# Altium schematic sheet PowerPath.SchDoc: Power Path
size A4; DrawnBy: A. Küllenberg; Revision: A; SheetNumber: 4; SheetTotal: 10
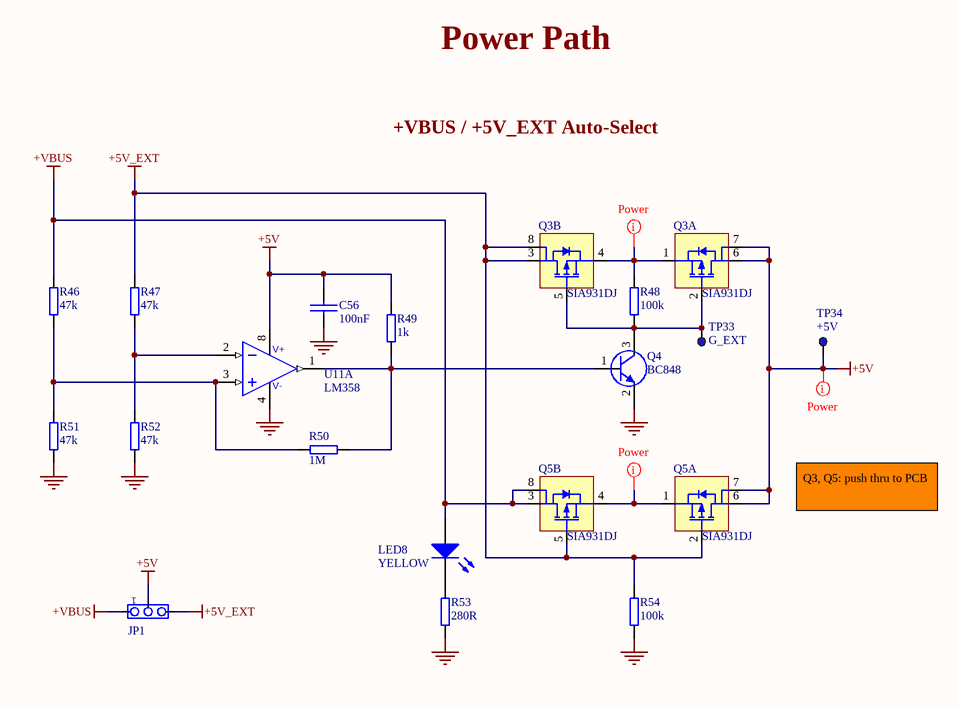
[diagram p0: PowerPath.SchDoc]

## Parts
C56  100nF  [C0603]
JP1  JP  [HDR1x3]  (value not drawn)
LED8  YELLOW  [LED_0603_YELLOW]
Q3  SIA931DJ  [PowerPAK SC-70-6L Dual]  (parts A,B of 2)
Q4  BC848  [SC-70]
Q5  SIA931DJ  [PowerPAK SC-70-6L Dual]  (parts A,B of 2)
R46  47k  [R0603]
R47  47k  [R0603]
R48  100k  [R0603]
R49  1k  [R0603]
R50  1M  [R0603]
R51  47k  [R0603]
R52  47k  [R0603]
R53  280R  [R0603]
R54  100k  [R0603]
TP33  G_EXT  [TP_1mm]  (no BOM)
TP34  +5V  [TP_1mm]  (no BOM)
U11  LM358  [DFN 2x2_LM358]  (part A of 2)

## Nets
+5V: C56.2 JP1.2 Q3.6(D1) Q3.7(D1) Q5.6(D1) Q5.7(D1) R49.2 TP34.1 U11.8(V+)
+5V_EXT: JP1.3 Q3.3(D2) Q3.8(D2) Q5.2(G1) Q5.5(G2) R47.2 R54.2
+VBUS: JP1.1 LED8.1(A) Q5.3(D2) Q5.8(D2) R46.2
GND: C56.1 Q4.2 R51.1 R52.1 R53.1 R54.1 U11.4(V-)
NetLED8_2: LED8.2(K) R53.2
NetQ3_1: Q3.1(S1) Q3.4(S2) R48.2
NetQ3_2: Q3.2(G1) Q3.5(G2) Q4.3 R48.1 TP33.1
NetQ4_1: Q4.1 R49.1 R50.1 U11.1(OUT)
NetQ5_1: Q5.1(S1) Q5.4(S2)
NetR46_1: R46.1 R50.2 R51.2 U11.3(IN+)
NetR47_1: R47.1 R52.2 U11.2(IN-)

## Layout directives
net class Power: +5V, NetQ3_1, NetQ5_1

## Notes on the sheet
- Power Path
- +VBUS / +5V_EXT Auto-Select
- Q3, Q5: push thru to PCB

## Library data of the parts
C56 = C0603C104K5RACTU: CAP CER 0.1UF 50V X7R 0603; Manufacturer: Kemet; Capacitance: 0.10µF; Tolerance: ±10%; Part Number: C0603C104K5RACTU; Value: 100nF; Supplier 1: Digi-Key; Supplier Part Number 1: 399-5089-1-ND; Manufacturer Part Number: C0603C104K5RACTU; RoHS: RoHS Compliant; Category: Capacitors; Stock 1: 1628757; Pricing 1: 1=0.09, 10=0.037, 50=0.0198, 100=0.0167, 250=0.01372, 500=0.01174, 1000=0.00914 (EUR); Packaging: Cut Tape (CT); Voltage - Rated: 50V; Temperature Coefficient: X7R; Mounting Type: Surface Mount, MLCC; Operating Temperature: -55°C ~ 125°C; Applications: General Purpose; Ratings: -; Package / Case: 0603 (1608 Metric); Size / Dimension: 0.063" L x 0.031" W (1.60mm x 0.80mm); Height - Seated (Max): -; Thickness (Max): 0.034" (0.87mm); Lead Spacing: -; Features: -; Lead Style: -; ComponentLink1URL: http://www.kemet.com/docfinder?Partnumber=C0603C104K5RACTU; ComponentLink1Description: http://www.kemet.com/docfinder?Partnumber=C0603C104K5RACTU
JP1 = 61300311121: CONN HEADER 3 POS 2.54; Manufacturer: Wurth Electronics Inc.; Pitch - Mating: 0.100" (2.54mm); Style: Board to Board or Cable; Shrouding: Unshrouded; Number of Positions: 3; Number of Positions Loaded: All; Contact Length - Mating: 0.236" (6.00mm); Contact Length - Post: 0.118" (3.00mm); Overall Contact Length: 0.454" (11.54mm); Material Flammability Rating: UL94 V-0; Current Rating: 3A; Voltage Rating: 250V; Part Number: 61300311121; Value: JP; Supplier 1: Digi-Key; Supplier Part Number 1: 732-5316-ND; Manufacturer Part Number: 61300311121; RoHS: RoHS Compliant; Category: Connectors, Interconnects; Stock 1: 31558; Pricing 1: 1=0.21, 10=0.191, 25=0.1628, 50=0.1424, 100=0.1323, 1000=0.09157 (EUR); Packaging: Bulk; Part Status: Active; Connector Type: Header; Contact Type: Male Pin; Number of Rows: 1; Row Spacing - Mating: -; Mounting Type: Through Hole; Termination: Solder; Fastening Type: -; Insulation Height: 0.100" (2.54mm); Contact Shape: Square; Contact Finish - Mating: Gold; Contact Finish Thickness - Mating: -; Contact Finish - Post: -; Contact Material: Copper Alloy; Insulation Material: Polybutylene Terephthalate (PBT); Features: -; Operating Temperature: -40°C ~ 125°C; Ingress Protection: -; Insulation Color: Black; Mated Stacking Heights: -; Contact Finish Thickness - Post: -; Applications: -; ComponentLink1URL: http://katalog.we-online.de/em/datasheet/6130xx11121.pdf; ComponentLink1Description: http://katalog.we-online.de/em/datasheet/6130xx11121.pdf
LED8 = LTST-C190KSKT: LED YELLOW CLEAR 0603 SMD; Manufacturer: Lite-On Inc.; Voltage - Forward (Vf) (Typ): 2.1V; Viewing Angle: 130°; Wavelength - Dominant: 591nm; Wavelength - Peak: 588nm; Millicandela Rating: 104mcd; Current - Test: 20mA; Lens Color: Colorless; Lens Style/Size: Rectangle with Flat Top, 1.10mm x 0.80mm; Part Number: LTST-C190KSKT; Value: YELLOW; Supplier 1: Digi-Key; Supplier Part Number 1: 160-1437-1-ND; Manufacturer Part Number: LTST-C190KSKT; RoHS: RoHS Compliant; Category: Optoelectronics; Stock 1: 229638; Pricing 1: 1=0.27, 10=0.199, 25=0.1468, 100=0.1049, 250=0.07132, 500=0.06292, 1000=0.0493 (EUR); Packaging: Cut Tape (CT); Mounting Type: Surface Mount; Package / Case: 0603 (1608 Metric); ComponentLink1URL: http://optoelectronics.liteon.com/upload/download/DS-22-99-0189/S_110_LTST-C190KSKT.pdf; ComponentLink1Description: http://optoelectronics.liteon.com/upload/download/DS-22-99-0189/S_110_LTST-C190KSKT.pdf; Color: Yellow; Lens Transparency: Clear; Size / Dimension: 1.60mm L x 0.80mm W; Height (Max): 0.80mm; Features: -; Part Status: Active
Q3 Q5 = SIA931DJ-T1-GE3: MOSFET 2P-CH 30V 4.5A SC70-6L; Manufacturer: Vishay Siliconix; FET Type: 2 P-Channel (Dual); FET Feature: Logic Level Gate; Rds On (Max) @ Id, Vgs: 65 mOhm @ 3A, 10V; Vgs(th) (Max) @ Id: 2.2V @ 250µA; Power - Max: 7.8W; Gate Charge (Qg) (Max) @ Vgs: 13nC @ 10V; Input Capacitance (Ciss) (Max) @ Vds: 445pF @ 15V; Part Number: SIA931DJ-T1-GE3; Value: SIA931DJ; Supplier 1: Digi-Key; Supplier Part Number 1: SIA931DJ-T1-GE3CT-ND; Manufacturer Part Number: SIA931DJ-T1-GE3; RoHS: RoHS Compliant; Category: Discrete Semiconductor Products; Stock 1: 5457; Pricing 1: 1=0.51, 10=0.44, 25=0.4108, 100=0.3287, 250=0.30524, 500=0.2583, 1000=0.19959 (EUR); Packaging: Cut Tape (CT); Drain to Source Voltage (Vdss): 30V; Current - Continuous Drain (Id) @ 25°C: 4.5A; Mounting Type: Surface Mount; Package / Case: PowerPAK® SC-70-6 Dual; Supplier Device Package: PowerPAK® SC-70-6 Dual; ComponentLink1URL: http://www.vishay.com/docs/62859/sia931dj.pdf; ComponentLink1Description: http://www.vishay.com/docs/62859/sia931dj.pdf; Operating Temperature: -55°C ~ 150°C (TJ); Part Status: Active
Q4 = BC848W,115: TRANS NPN 30V 0.1A SOT323; Manufacturer: Nexperia USA Inc.; Current - Collector (Ic) (Max): 100mA; Vce Saturation (Max) @ Ib, Ic: 600mV @ 5mA, 100mA; Current - Collector Cutoff (Max): 15nA (ICBO); DC Current Gain (hFE) (Min) @ Ic, Vce: 110 @ 2mA, 5V; Power - Max: 200mW; Frequency - Transition: 100MHz; Part Number: BC848W,115; Value: BC848; Supplier 1: Digi-Key; Supplier Part Number 1: 1727-6193-1-ND; Manufacturer Part Number: BC848W,115; RoHS: RoHS Compliant; Category: Discrete Semiconductor Products; Stock 1: 2939; Pricing 1: 1=0.13, 10=0.12, 100=0.0651, 500=0.04004, 1000=0.02731 (EUR); Packaging: Cut Tape (CT); Part Status: Active; Transistor Type: NPN; Voltage - Collector Emitter Breakdown (Max): 30V; Operating Temperature: 150°C (TJ); Mounting Type: Surface Mount; Package / Case: SC-70, SOT-323; Supplier Device Package: SOT-323-3; ComponentLink1URL: http://assets.nexperia.com/documents/data-sheet/BC848_SER.pdf; ComponentLink1Description: http://assets.nexperia.com/documents/data-sheet/BC848_SER.pdf
R46 R47 R51 R52 = RC0603FR-0747KL: RES SMD 47K OHM 1% 1/10W 0603; Manufacturer: Yageo; Power (Watts): 0.1W, 1/10W; Temperature Coefficient: ±100ppm/°C; Part Number: RC0603FR-0747KL; Value: 47k; Manufacturer Part Number: RC0603FR-0747KL; RoHS: RoHS Compliant; Category: Resistors; Stock 1: 2291730; Pricing 1: 1=0.09, 10=0.012, 25=0.0088, 50=0.007, 100=0.0051, 250=0.00388, 500=0.0031, 1000=0.00229 (EUR); Packaging: Cut Tape (CT); Resistance (Ohms): 47k; Tolerance: ±1%; Composition: Thick Film; Features: Moisture Resistant; Operating Temperature: -55°C ~ 155°C; Package / Case: 0603 (1608 Metric); Supplier Device Package: 0603; Size / Dimension: 0.063" L x 0.031" W (1.60mm x 0.80mm); ComponentLink1URL: http://www.yageo.com/documents/recent/PYu-RC_Group_51_RoHS_L_7.pdf; ComponentLink1Description: http://www.yageo.com/documents/recent/PYu-RC_Group_51_RoHS_L_7.pdf; Supplier 1: Digi-Key; Supplier Part Number 1: 311-47.0KHRCT-ND; Height - Seated (Max): 0.022" (0.55mm); Part Status: Active; Failure Rate: -
R48 R54 = RC0603FR-07100KL: RES SMD 100K OHM 1% 1/10W 0603; Manufacturer: Yageo; Power (Watts): 0.1W, 1/10W; Temperature Coefficient: ±100ppm/°C; Part Number: RC0603FR-07100KL; Value: 100k; Manufacturer Part Number: RC0603FR-07100KL; RoHS: RoHS Compliant; Category: Resistors; Stock 1: 6595647; Pricing 1: 1=0.09, 10=0.012, 25=0.0088, 50=0.007, 100=0.0051, 250=0.00388, 500=0.0031, 1000=0.00229 (EUR); Packaging: Cut Tape (CT); Resistance (Ohms): 100k; Tolerance: ±1%; Composition: Thick Film; Features: Moisture Resistant; Operating Temperature: -55°C ~ 155°C; Package / Case: 0603 (1608 Metric); Supplier Device Package: 0603; Size / Dimension: 0.063" L x 0.031" W (1.60mm x 0.80mm); ComponentLink1URL: http://www.yageo.com/documents/recent/PYu-RC_Group_51_RoHS_L_7.pdf; ComponentLink1Description: http://www.yageo.com/documents/recent/PYu-RC_Group_51_RoHS_L_7.pdf; Supplier 1: Digi-Key; Supplier Part Number 1: 311-100KHRCT-ND; Height - Seated (Max): 0.022" (0.55mm); Part Status: Active; Failure Rate: -
R49 = CRCW06031K00FKEA: RES SMD 1K OHM 1% 1/10W 0603; Manufacturer: Vishay Dale; Power (Watts): 0.1W, 1/10W; Temperature Coefficient: ±100ppm/°C; Part Number: CRCW06031K00FKEA; Value: 1k; Manufacturer Part Number: CRCW06031K00FKEA; RoHS: RoHS Compliant; Category: Resistors; Stock 1: 862886; Pricing 1: 1=0.09, 10=0.027, 25=0.0196, 50=0.015, 100=0.011, 250=0.0084, 500=0.00674, 1000=0.00496, 2500=0.00431 (EUR); Packaging: Cut Tape (CT); Resistance (Ohms): 1k; Tolerance: ±1%; Composition: Thick Film; Features: Automotive AEC-Q200; Operating Temperature: -55°C ~ 155°C; Package / Case: 0603 (1608 Metric); Supplier Device Package: 0603; Size / Dimension: 0.061" L x 0.033" W (1.55mm x 0.85mm); Height: 0.020" (0.50mm); Number of Terminations: 2; ComponentLink1URL: http://www.vishay.com/docs/20035/dcrcwe3.pdf; ComponentLink1Description: http://www.vishay.com/docs/20035/dcrcwe3.pdf; Supplier 1: Digi-Key; Supplier Part Number 1: 541-1.00KHCT-ND
R50 = RC0603FR-071ML: RES SMD 1M OHM 1% 1/10W 0603; Manufacturer: Yageo; Power (Watts): 0.1W, 1/10W; Temperature Coefficient: ±100ppm/°C; Part Number: RC0603FR-071ML; Value: 1M; Manufacturer Part Number: RC0603FR-071ML; RoHS: RoHS Compliant; Category: Resistors; Stock 1: 3055845; Pricing 1: 1=0.09, 10=0.012, 25=0.0088, 50=0.0066, 100=0.0049, 250=0.00372, 500=0.00298, 1000=0.0022 (EUR); Packaging: Cut Tape (CT); Resistance (Ohms): 1M; Tolerance: ±1%; Composition: Thick Film; Features: Moisture Resistant; Operating Temperature: -55°C ~ 155°C; Package / Case: 0603 (1608 Metric); Supplier Device Package: 0603; Size / Dimension: 0.063" L x 0.031" W (1.60mm x 0.80mm); ComponentLink1URL: http://www.yageo.com/documents/recent/PYu-RC_Group_51_RoHS_L_7.pdf; ComponentLink1Description: http://www.yageo.com/documents/recent/PYu-RC_Group_51_RoHS_L_7.pdf; Supplier 1: Digi-Key; Supplier Part Number 1: 311-1.00MHRCT-ND; Height - Seated (Max): 0.022" (0.55mm); Part Status: Active; Failure Rate: -
R53 = RC0603FR-07280RL: RES SMD 280 OHM 1% 1/10W 0603; Manufacturer: Yageo; Resistance (Ohms): 280; Power (Watts): 0.1W, 1/10W; Temperature Coefficient: ±100ppm/°C; Part Number: RC0603FR-07280RL; Value: 280R; Manufacturer Part Number: RC0603FR-07280RL; RoHS: RoHS Compliant; Category: Resistors; Stock 1: 47; Pricing 1: 1=0.09, 10=0.012, 25=0.0088, 50=0.0066, 100=0.0049, 250=0.00372, 500=0.00298, 1000=0.0022 (EUR); Packaging: Cut Tape (CT); Tolerance: ±1%; Composition: Thick Film; Features: Moisture Resistant; Operating Temperature: -55°C ~ 155°C; Package / Case: 0603 (1608 Metric); Supplier Device Package: 0603; Size / Dimension: 0.063" L x 0.031" W (1.60mm x 0.80mm); ComponentLink1URL: http://www.yageo.com/documents/recent/PYu-RC_Group_51_RoHS_L_6.pdf; ComponentLink1Description: http://www.yageo.com/documents/recent/PYu-RC_Group_51_RoHS_L_6.pdf; Supplier 1: Digi-Key; Supplier Part Number 1: 311-280HRCT-ND; Height - Seated (Max): 0.022" (0.55mm); Part Status: Active; Failure Rate: -
TP33 TP34 = TP: Value: TP; Part Number: TP
U11 = LM358QT: IC OPAMP GP 1.1MHZ 8DFN; Manufacturer: STMicroelectronics; Amplifier Type: General Purpose; Number of Circuits: 2; Slew Rate: 0.6 V/µs; Current - Supply: 700µA; Current - Output / Channel: 60mA; Voltage - Supply, Single/Dual (±): 3 V ~ 30 V, ±1.5 V ~ 15 V; Part Number: LM358QT; Value: LM358; Supplier 1: Digi-Key; Supplier Part Number 1: 497-12007-1-ND; Manufacturer Part Number: LM358QT; RoHS: RoHS Compliant; Category: Integrated Circuits (ICs); Stock 1: 1511; Pricing 1: 1=0.43, 10=0.324, 100=0.2013, 500=0.13776, 1000=0.10596 (EUR); Packaging: Cut Tape (CT); Output Type: -; -3db Bandwidth: -; Operating Temperature: 0°C ~ 70°C; Mounting Type: Surface Mount; Package / Case: 8-UFDFN Exposed Pad; Supplier Device Package: 8-DFN (2x2); ComponentLink1URL: http://www.st.com/content/ccc/resource/technical/document/datasheet/61/46/87/01/98/ed/44/c5/CD00000464.pdf/files/CD00000464.pdf/jcr:content/translations/en.CD00000464.pdf; ComponentLink1Description: http://www.st.com/content/ccc/resource/technical/document/datasheet/61/46/87/01/98/ed/44/c5/CD00000464.pdf/files/CD00000464.pdf/jcr:content/translations/en.CD00000464.pdf; Part Status: Active